# EAGLE design snow depth gauge 2B (EAGLE 6.5.0)
Trimble Ultrasonic Snow Depth Gauge
DATABASE: ./parts.txt
Assembly variants: 2B
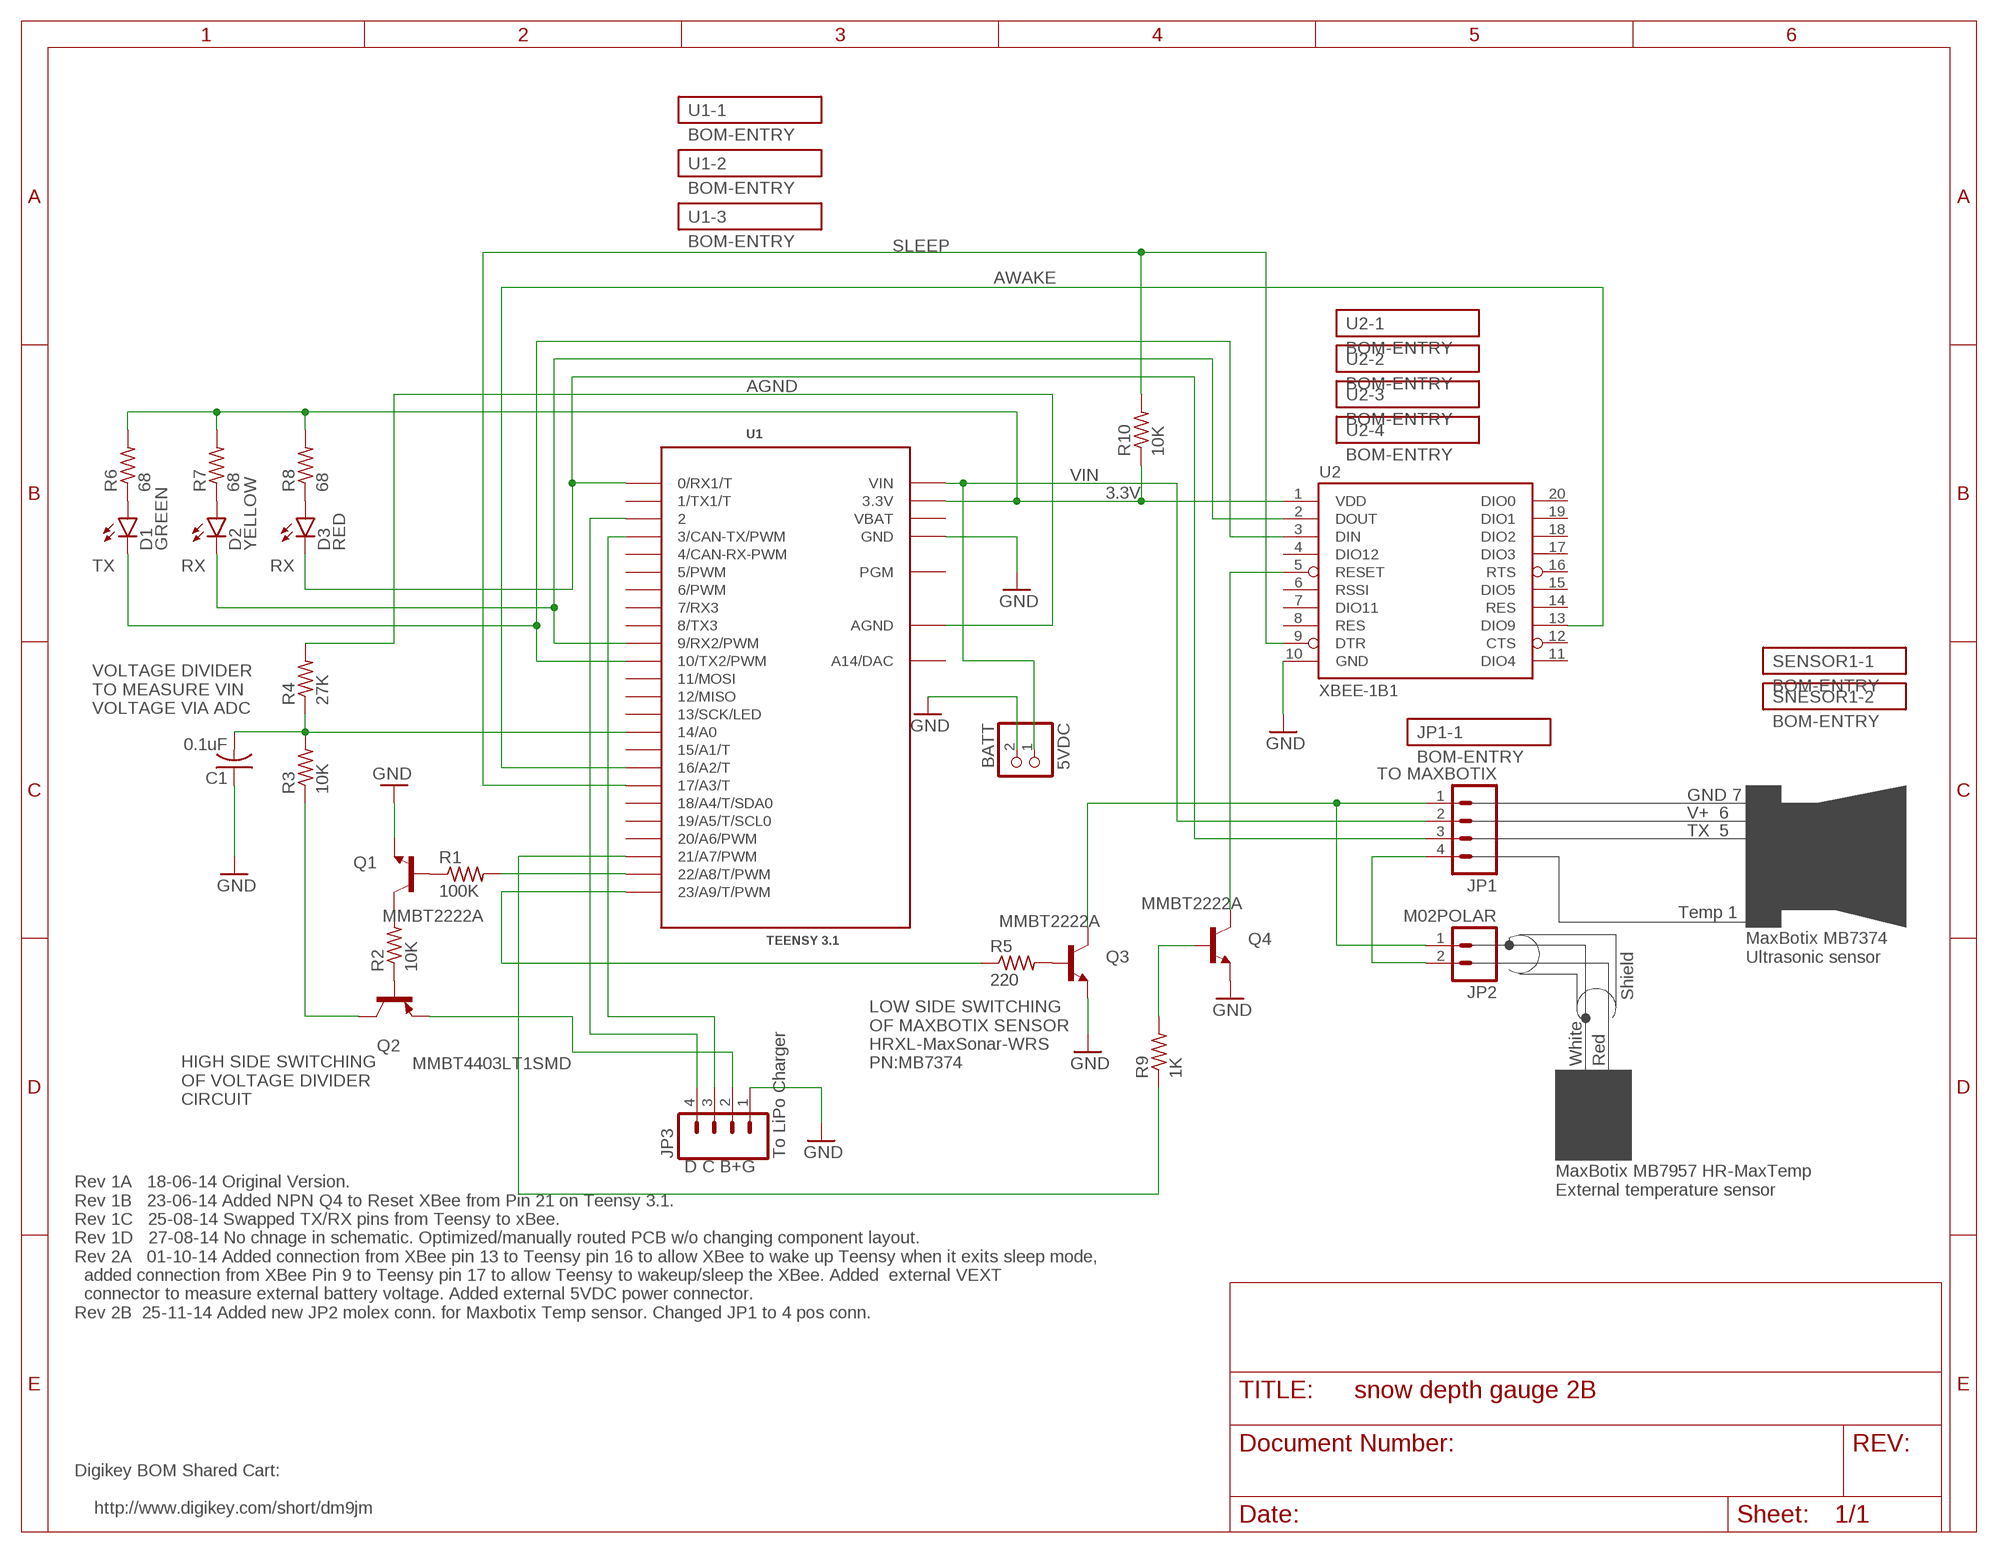
[diagram p0: schematic, sheet 1]
JP1-1 (BOM-ENTRY): PARTNO: PRT-09920
SENSOR1-1 (BOM-ENTRY): PARTNO: MB7374
SNESOR1-2 (BOM-ENTRY): PARTNO: MB7957
U1-1 (BOM-ENTRY): PARTNO: 961114-6404-AR
U1-2 (BOM-ENTRY): PARTNO: 961114-6404-AR
U1-3 (BOM-ENTRY): PARTNO: 961105-6404-AR
U2-1 (BOM-ENTRY): PARTNO: 831-87-010-10-001101
U2-2 (BOM-ENTRY): PARTNO: 831-87-010-10-001101
U2-3 (BOM-ENTRY): PARTNO: RN-UFL-SMA6
U2-4 (BOM-ENTRY): PARTNO: W1038

## Parts
BATT  5VDC  JST_2PIN-SMT-RA  [JST-PH-2-SMT-RA]
C1  0.1uF  C-USC3216  [C3216]
D1  GREEN  LED-GREEN0603  [LED-0603]
D2  YELLOW  LED-YELLOW0603  [LED-0603]
D3  RED  LED-RED0603  [LED-0603]
JP1  TO MAXBOTIX  M04POLAR  [MOLEX-1X4]
JP2  M02POLAR  [MOLEX-1X2]
JP3  To LiPo Charger  M04POLAR  [MOLEX-1X4]
Q1  MMBT2222A  MMBT2222ALT1-NPN-SOT23-BEC  [SOT23-BEC]
Q2  MMBT4403LT1SMD  [SOT23-BEC]
Q3  MMBT2222A  MMBT2222ALT1-NPN-SOT23-BEC  [SOT23-BEC]
Q4  MMBT2222A  MMBT2222ALT1-NPN-SOT23-BEC  [SOT23-BEC]
R1  100K  R-US_R3216  [R3216]
R2  10K  R-US_R3216  [R3216]
R3  10K  R-US_R3216  [R3216]
R4  27K  R-US_R3216  [R3216]
R5  220  R-US_R3216  [R3216]
R6  68  R-US_R3216  [R3216]
R7  68  R-US_R3216  [R3216]
R8  68  R-US_R3216  [R3216]
R9  1K  R-US_R3216  [R3216]
R10  10K  R-US_R3216  [R3216]
U1  TEENSY 3.1  TEENSY_3.1_BASIC  [TEENSY_3.1_BASIC]
U2  XBEE-1B1  [XBEE-1]

## Nets
3.3V: R6.2 R7.2 R8.2 R10.1 U1.3.3V U1.3.3V1(3.3V) U2.1(VDD)
22: R1.2 U1.22/A8(22/A8/T/PWM)
23: R5.1 U1.23/A9(23/A9/T/PWM)
A0: C1.2 R3.2 R4.1 U1.14/A0
AGND: R4.2 U1.AGND
AWAKE: U1.16/A2(16/A2/T) U2.13(DIO9)
GND: BATT.2 C1.1 JP3.1 Q1.E Q3.E Q4.E U1.GND U1.GND1(GND) U2.10(GND)
IN: D2.C U1.9(9/RX2/PWM) U2.2(DOUT)
MBGND: JP1.1 JP2.1 Q3.C
MBTEMP: JP1.4 JP2.2
N$1: D3.A R8.1
N$2: Q4.B R9.2
N$3: Q4.C U2.5(RESET)
N$4: JP3.2 Q2.E
N$5: Q3.B R5.2
N$6: Q1.B R1.1
N$7: Q1.C R2.2
N$8: Q2.B R2.1
N$9: D1.A R6.1
N$11: Q2.C R3.1
N$15: D2.A R7.1
OUT: D1.C U1.10(10/TX2/PWM) U2.3(DIN)
RESET: R9.1 U1.21/A7(21/A7/PWM)
RX1: D3.C JP1.3 U1.0(0/RX1/T)
SLEEP: R10.2 U1.17/A3(17/A3/T) U2.9(DTR)
STAT1: JP3.4 U1.2
STAT2: JP3.3 U1.3(3/CAN-TX/PWM)
VIN: BATT.1 JP1.2 U1.VIN
Unconnected: U1.1(1/TX1/T) U1.4(4/CAN-RX-PWM) U1.5(5/PWM) U1.6(6/PWM) U1.7(7/RX3) U1.8(8/TX3) U1.11(11/MOSI) U1.12(12/MISO) U1.13(13/SCK/LED) U1.15/A1(15/A1/T) U1.18/A4(18/A4/T/SDA0) U1.19/A5(19/A5/T/SCL0) U1.20/A6(20/A6/PWM) U1.A14(A14/DAC) U1.PGM U2.4(DIO12) U2.6(RSSI) U2.7(DIO11) U2.8(RES) U2.11(DIO4) U2.12(CTS) U2.14(RES) U2.15(DIO5) U2.16(RTS) U2.17(DIO3) U2.18(DIO2) U2.19(DIO1) U2.20(DIO0)

## Notes on the sheet
- TX | RX | RX
- VOLTAGE DIVIDER
  TO MEASURE VIN
  VOLTAGE VIA ADC
- GND 7
- V+  6
- TX  5
- Temp 1
- MaxBotix MB7374
  Ultrasonic sensor
- Shield
- White | Red
- LOW SIDE SWITCHING
  OF MAXBOTIX SENSOR
  HRXL-MaxSonar-WRS
  PN:MB7374
- HIGH SIDE SWITCHING
  OF VOLTAGE DIVIDER
  CIRCUIT
- D C B+G
- MaxBotix MB7957 HR-MaxTemp
  External temperature sensor
- Rev 1A   18-06-14 Original Version.
  Rev 1B   23-06-14 Added NPN Q4 to Reset XBee from Pin 21 on Teensy 3.1.
  Rev 1C   25-08-14 Swapped TX/RX pins from Teensy to xBee.
  Rev 1D   27-08-14 No chnage in schematic. Optimized/manually routed PCB w/o changing component layout.
  Rev 2A   01-10-14 Added connection from XBee pin 13 to Teensy pin 16 to allow XBee to wake up Teensy when it exits sleep mode,
    added connection from XBee Pin 9 to Teensy pin 17 to allow Teensy to wakeup/sleep the XBee. Added  external VEXT 
    connector to measure external battery voltage. Added external 5VDC power connector.
  Rev 2B  25-11-14 Added new JP2 molex conn. for Maxbotix Temp sensor. Changed JP1 to 4 pos conn.
- Digikey BOM Shared Cart: 
  
      http://www.digikey.com/short/dm9jm

## Power pins joined to a net without a drawn wire
VBAT: U1.VBAT

## Library data of the parts
BATT = adafruit:JST_2PIN: JST 2-Pin Connectors of various flavors SMT-RA (S2B-PH-SM4) 4UConnector #17311 SMT (B2B-PH-SM4) THM-RA (S2B-PH) THM (B2B-PH); PARTNO: S2B-PH-SM4-TB(LF)(SN)
C1 = resistor:C-US: CAPACITOR, American symbol; PARTNO: C1206C104K4RACTU
D1 = SparkFun-LED:LED-GREEN: Various green LEDs Green LEDs used in SFE Production 0603- DIO-00821 LARGE- DIO-00862 LILYPAD- DIO-09910; PARTNO: LNJ337W83RA; PROD_ID: DIO-00821
D2 = SparkFun-LED:LED-YELLOW: Yellow SMD LEDs LilyPad 1206- DIO-09909 0603- DIO-09003; PARTNO: LNJ437W84RA; PROD_ID: DIO-09003
D3 = SparkFun-LED:LED-RED: Assorted Red LEDs LilyPad 1206- DIO-09912 1206- DIO-00809 0603- DIO-00819; PARTNO: LNJ237W82RA; PROD_ID: DIO-00819
JP1 JP3 = SparkFun-Connectors:M04: Header 4 Standard 4-pin 0.1" header. Use with straight break away headers (SKU : PRT-00116), right angle break away headers (PRT-00553), swiss pins (PRT-00743), machine pins (PRT-00117), and female headers (PRT-00115). Molex polarized connector foot print use with SKU : PRT-08231 with associated crimp pins and housings. 1MM SMD Version SKU: PRT-10208; PARTNO: 0022292041
JP2 = SparkFun-Connectors:M02: Standard 2-pin 0.1" header. Use with - straight break away headers ( PRT-00116) - right angle break away headers (PRT-00553) - swiss pins (PRT-00743) - machine pins (PRT-00117) - female headers (PRT-00115) Molex polarized connector foot print use with: PRT-08233 with associated crimp pins and housings. 2.54_SCREWTERM for use with PRT-10571. 3.5mm Screw Terminal footprints for PRT-08084 5mm Screw Terminal footprints for use with PRT-08433; PARTNO: 0022292021
Q1 Q3 Q4 = transistor-neu-to92:*-NPN-: NPN Transistror; PARTNO: MMBT2222A
Q2 = transistor-pnp:MMBT4403*: PNP Transistror; PARTNO: MMBT4403
R1 = resistor:R-US_: RESISTOR, American symbol; PARTNO: KTR18EZPJ104
R2 R3 R10 = resistor:R-US_: RESISTOR, American symbol; PARTNO: KTR18EZPJ103
R4 = resistor:R-US_: RESISTOR, American symbol; PARTNO: KTR18EZPJ273
R5 = resistor:R-US_: RESISTOR, American symbol; PARTNO: KTR18EZPJ221
R6-R8 = resistor:R-US_: RESISTOR, American symbol; PARTNO: KTR18EZPJ680
R9 = resistor:R-US_: RESISTOR, American symbol; PARTNO: KTR18EZPJ102
U1 = Teensy_3_Series_Board_v1.0:TEENSY_3.1_BASIC: Footprint for Teensy 3.1 board using all pin connections on the outer perimeter; PARTNO: TEENSY31
U2 = SparkFun-RF:XBEE-1: Xbee module footprints SMT header is CONN-09042.; PARTNO: XB24-AUI-001

## Board
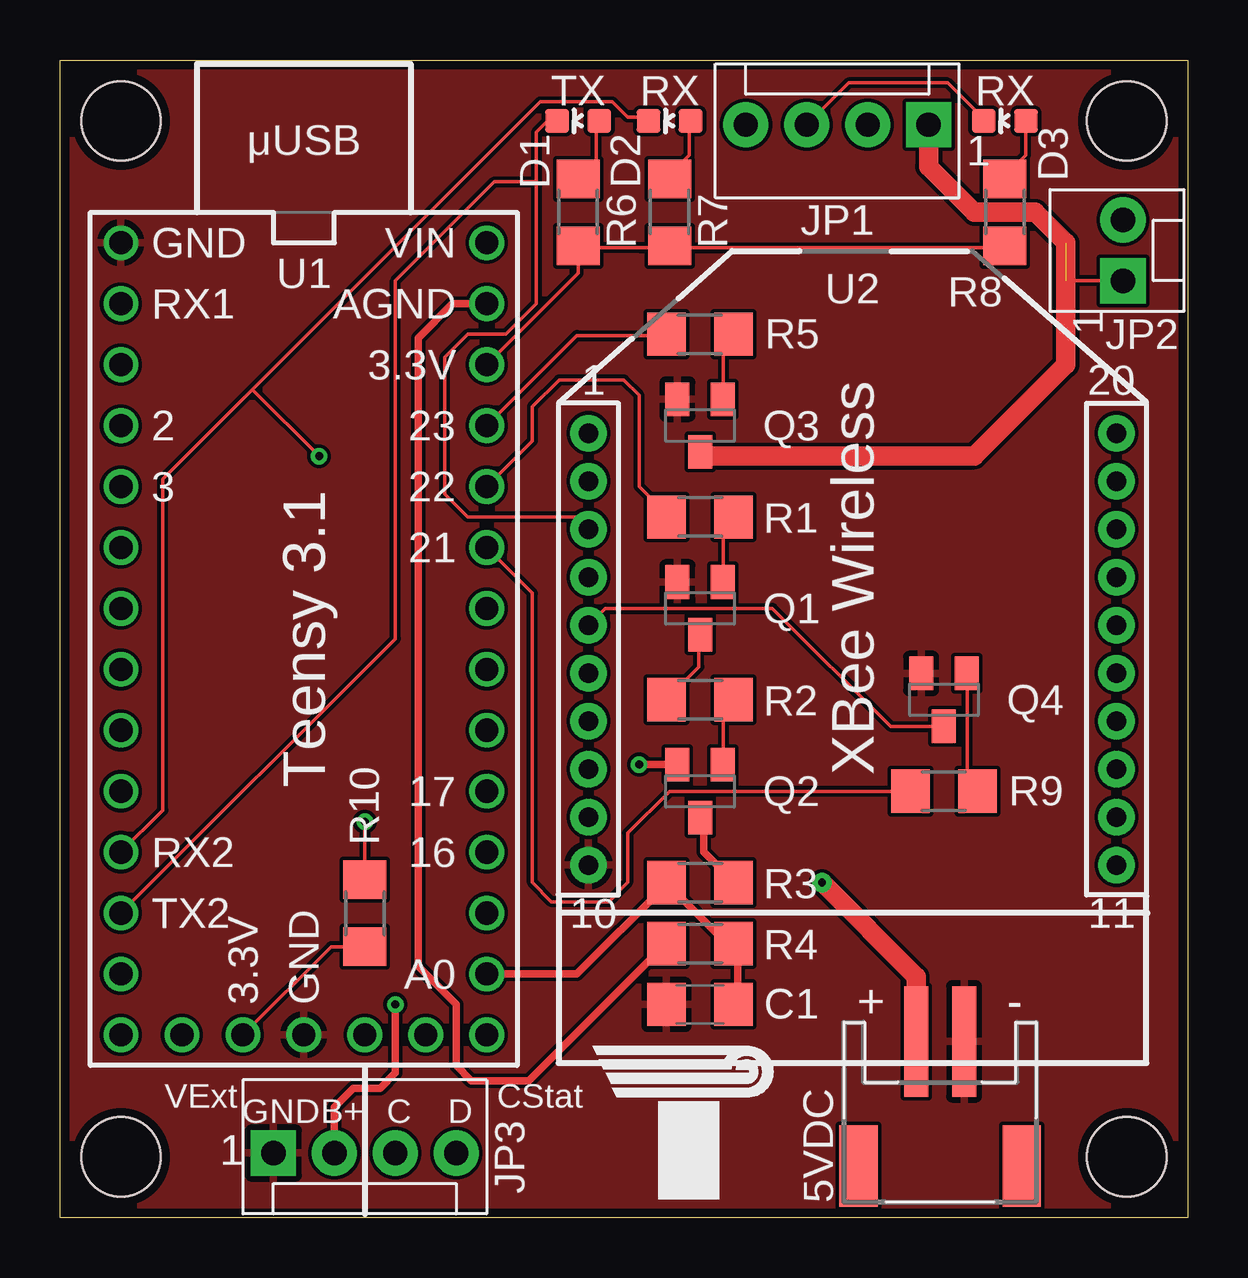
[diagram p1: board, top side]
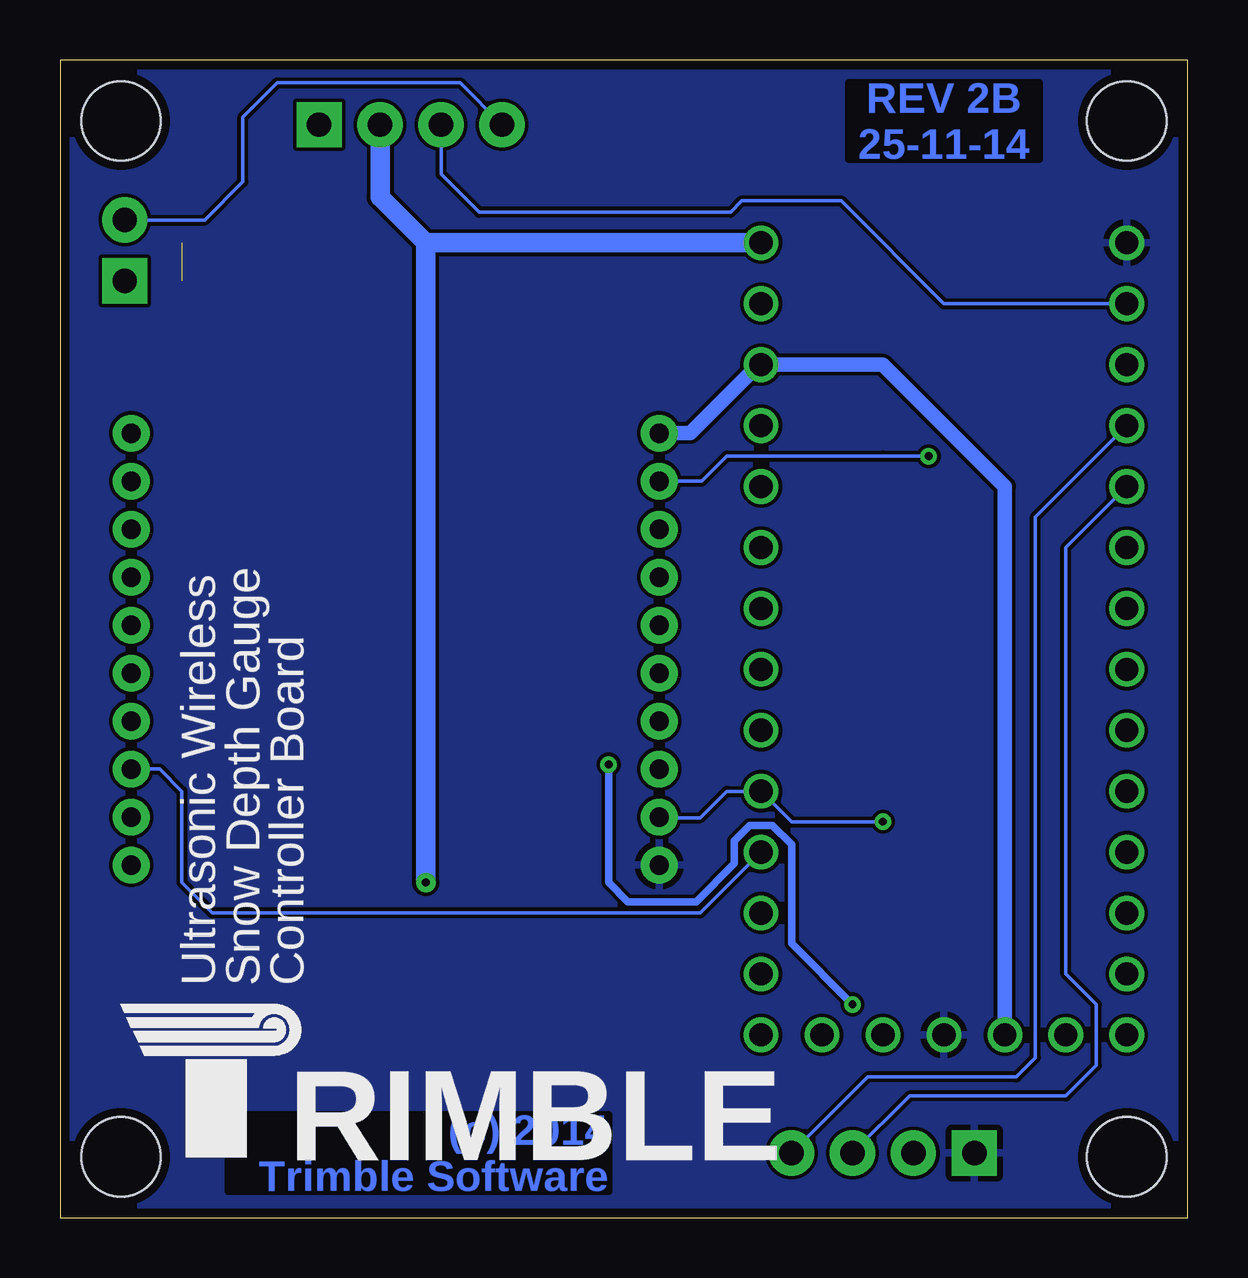
[diagram p2: board, bottom side, seen from below]

Size 46.99 x 48.26 mm. Coordinates in mm from the lower left corner, seen from the top.
Outline: 0,0 0,48.26 46.99,48.26 46.99,0 0,0
Copper layers (1*16): Top 0.0356mm / dielectric 1.5011mm / Bottom 0.0356mm
Design rules "LaenPCBOrder": minimum track width 6mil, minimum drill 13mil, track to track 6mil, track to pad 6mil, pad to pad 6mil, via to via 6mil, smd to smd 6mil, copper to edge 15mil, drill to drill 6mil, minimum pad ring 7mil, minimum via ring 7mil, stop-mask expansion 3mil, vias tented up to drill 0mil, thermal gap 10mil
tKeepout: area 5.7,41.9 to 14.6,48.3

### Footprints (pad centres in the part's own frame; a part is rotated, then mirrored left to right if it is on the bottom)
JST-PH-2-SMT-RA = smd 1 x 4.6: 1 1,-3.7; 2 -1,-3.7 | smd 1.6 x 3.4: NC1 -3.4,1.5; NC2 3.4,1.5
C3216 = smd 1.6 x 1.8: 1 -1.4,0; 2 1.4,0
LED-0603 = smd 1 x 1: A 0,-0.877; C 0,0.877
MOLEX-1X4 = drill 1.016 pad 1.88 square: 1 0,0 | drill 1.016 pad 1.88: 2 2.54,0; 3 5.08,0; 4 7.62,0
MOLEX-1X2 = drill 1.016 pad 1.88 square: 1 0,0 | drill 1.016 pad 1.88: 2 2.54,0
SOT23-BEC = smd 1 x 1.4: B -0.95,-1.1; C 0,1.1; E 0.95,-1.1
R3216 = smd 1.6 x 1.8: 1 -1.4,0; 2 1.4,0
TEENSY_3.1_BASIC = drill 0.965: 0 -7.62,13.97; 1 -7.62,11.43; 2 -7.62,8.89; 3 -7.62,6.35; 3.3V 7.62,11.43; 3.3V1 -2.54,-16.51; 4 -7.62,3.81; 5 -7.62,1.27; 6 -7.62,-1.27; 7 -7.62,-3.81; 8 -7.62,-6.35; 9 -7.62,-8.89; 10 -7.62,-11.43; 11 -7.62,-13.97; 12 -7.62,-16.51; 13 7.62,-16.51; 14/A0 7.62,-13.97; 15/A1 7.62,-11.43; 16/A2 7.62,-8.89; 17/A3 7.62,-6.35; 18/A4 7.62,-3.81; 19/A5 7.62,-1.27; 20/A6 7.62,1.27; 21/A7 7.62,3.81; 22/A8 7.62,6.35; 23/A9 7.62,8.89; A14 5.08,-16.51; AGND 7.62,13.97; GND -7.62,16.51; GND1 0,-16.51; PGM 2.54,-16.51; VBAT -5.08,-16.51; VIN 7.62,16.51
XBEE-1 = drill 0.8 pad 1.524: 1 -11,20; 2 -11,18; 3 -11,16; 4 -11,14; 5 -11,12; 6 -11,10; 7 -11,8; 8 -11,6; 9 -11,4; 10 -11,2; 11 11,2; 12 11,4; 13 11,6; 14 11,8; 15 11,10; 16 11,12; 17 11,14; 18 11,16; 19 11,18; 20 11,20
STAND-OFF = hole 3.302: 0,0

### Placement (x,y rotation side)
BATT  36.67,3.65 180 top
C1  26.67,8.89 0 top
D1  21.59,45.72 90 top
D2  25.4,45.72 90 top
D3  39.37,45.72 90 top
JP1  36.2,45.56 180 top
JP2  44.29,39.05 90 top
JP3  8.89,2.7 0 top
Q1  26.67,25.4 180 top
Q2  26.67,17.78 180 top
Q3  26.67,33.02 180 top
Q4  36.83,21.59 180 top
R1  26.67,29.21 180 top
R2  26.67,21.59 180 top
R3  26.67,13.97 180 top
R4  26.67,11.43 180 top
R5  26.67,36.83 0 top
R6  21.59,41.91 270 top
R7  25.4,41.91 270 top
R8  39.37,41.91 270 top
R9  36.83,17.78 0 top
R10  12.7,12.7 90 top
U1  10.16,24.13 0 top
U2  33.02,12.7 0 top
U$1  [STAND-OFF]  2.54,2.54 0 top
U$2  [STAND-OFF]  2.54,45.72 0 top
U$3  [STAND-OFF]  44.45,2.54 0 top
U$4  [STAND-OFF]  44.45,45.72 0 top
U$5  [LOGO_4]  24.92,0.79 0 top
U$6  [LOGO_4_BOTTOM]  41.75,2.54 0 top

### Tracks (layer width: path | path; a pad name or v marks a point on that pad's centre or on a via)
3.3V
  Top 0.152: 24.18,40.44 39.22,40.44 R8.2 | 24.18,40.44 R7.2 | 24.18,40.44 21.74,40.44 R6.2 | 21.54,40.44 R6.2 | U1.3.3V 21.59,39.37 R6.2 | R10.1 11.3,11.3 U1.3.3V1
  Bottom 0.152: 17.68,35.56 U1.3.3V 17.88,35.56 | 21.95,32.72 U2.1
  Bottom 0.61: 21.95,32.72 20.73,32.72 17.88,35.56 | U1.3.3V1 7.62,30.48 12.7,35.56 U1.3.3V
22
  Top 0.152: R1.2 25.2,29.26 24.77,29.69 24.77,29.84 24.13,30.48 24.13,34.29 23.5,34.92 20.8,34.92 19.68,33.81 19.68,32.38 U1.22/A8
23
  Top 0.152: U1.23/A9 21.54,36.78 25.2,36.78 R5.1
A0
  Top 0.152: 25.2,13.82 R3.2 25.4,13.82 | 28.25,8.94 C1.2 | 28.25,11.38 R4.1 28.04,11.58 27.64,11.58
  Top 0.305: U1.14/A0 21.54,10.16 25.2,13.82 | 28.25,11.38 28.25,8.94 | 25.4,13.82 27.64,11.58
AGND
  Top 0.152: 25.2,11.38 R4.2
  Top 0.305: 25.2,11.38 19.53,5.71 17.14,5.71 16.51,6.35 16.51,8.89 14.92,10.48 14.92,36.67 16.35,38.1 U1.AGND
AWAKE
  Bottom 0.152: U2.13 42.83,18.7 41.91,17.78 41.91,13.97 40.64,12.7 20.32,12.7 U1.16/A2
GND
  pour Bottom: 0,48.26 46.99,48.26 46.99,0 0,0
  pour Top: 0,48.26 46.99,48.26 46.99,0 0,0
IN  (via drill 0.33)
  Top 0.152: U1.9 4.29,16.99 4.29,30.8 8.02,34.53 | D2.C 24.36,45.88 23.65,45.88 23.02,46.51 20,46.51 8.02,34.53 | v10.79,31.74 8.02,34.52 8.02,34.53
  Bottom 0.152: U2.2 20.26,30.7 19.21,31.75 12.7,31.75 v10.79,31.74
MBGND  (1 unrouted)
  Top 0.152: Q3.C 26.62,31.9 26.84,31.75 | JP2.1 41.91,39.05
  Top 0.813: 26.84,31.75 38.1,31.75 41.91,35.56 41.91,40.64 40.64,41.91 38.1,41.91 36.2,43.81 JP1.1
MBTEMP
  Bottom 0.152: JP2.2 40.96,41.59 39.37,43.18 39.37,45.88 37.94,47.31 30.32,47.31 JP1.4
N$1
  Top 0.152: D3.A 40.23,45.72 40.23,44.3 39.42,43.48 R8.1
N$2
  Top 0.152: Q4.B 37.8,22.55 37.8,18.29 38.2,17.88 R9.2
N$3
  Top 0.152: 36.78,20.52 Q4.C 36.82,20.48 34.61,20.48 29.69,25.4 22.72,25.4 U2.5
N$4  (via drill 0.33)
  Top 0.305: Q2.E 25.71,18.89 v24.13,18.89 | JP3.2 11.43,4.6 12.22,5.4 13.34,5.4 13.97,6.03 v13.97,8.89
  Bottom 0.305: v13.97,8.89 16.51,11.43 16.51,15.56 17.3,16.35 18.26,16.35 18.89,15.72 18.89,14.76 20.48,13.18 23.34,13.18 24.13,13.97 v24.13,18.89
N$5
  Top 0.152: Q3.B 27.64,34.14 27.64,36.37 28.04,36.78 R5.2
N$6
  Top 0.152: Q1.B 27.64,26.62 27.64,28.65 28.04,29.06 R1.1
N$7
  Top 0.152: Q1.C 26.62,24.18 26.62,22.96 25.4,21.74 R2.2
N$8
  Top 0.152: Q2.B 27.64,18.9 27.64,21.13 28.04,21.54 R2.1
N$9
  Top 0.152: D1.A 22.35,45.72 22.35,44.09 21.74,43.48 R6.1
N$11
  Top 0.152: 26.82,16.66 Q2.C | 28.04,14.02 R3.1
  Top 0.305: 26.82,16.66 26.82,15.24 28.04,14.02
N$15
  Top 0.152: D2.A 26.21,45.72 26.21,44.3 25.4,43.48 R7.1
OUT
  Top 0.152: U2.3 21.51,29.21 16.99,29.21 16.03,30.16 16.03,35.88 16.99,36.83 18.57,36.83 19.84,38.1 19.84,43.18 | D1.C 20.32,45.72 19.84,45.24 19.84,43.18 | U1.10 13.97,24.13 13.97,39.05 18.1,43.18 19.84,43.18
RESET
  Top 0.152: U1.21/A7 19.68,26.04 19.68,13.97 20.48,13.18 22.86,13.18 23.65,13.97 23.65,16.03 25.4,17.78 35.26,17.78 35.36,17.68 R9.1
RX1
  Top 0.152: D3.C 38.49,45.8 36.99,47.31 32.86,47.31 JP1.3
  Bottom 0.152: U1.0 10.16,38.1 14.45,42.39 18.57,42.39 19.05,41.91 29.53,41.91 31.11,43.5 JP1.3
SLEEP  (via drill 0.33)
  Top 0.152: v12.7,16.51 R10.2
  Bottom 0.152: U2.9 21.99,16.67 20.32,16.67 19.21,17.78 U1.17/A3 16.51,16.51 v12.7,16.51
STAT1
  Bottom 0.152: U1.2 6.35,29.21 6.35,6.67 7.14,5.87 13.34,5.87 JP3.4
STAT2
  Bottom 0.152: U1.3 5.08,27.94 5.08,10.16 3.81,8.89 3.81,6.35 5.08,5.08 11.59,5.08 JP3.3
VIN  (via drill 0.33 pad 0.81)
  Top 0.813: BATT.1 35.67,10.05 v31.75,13.97
  Bottom 0.813: 31.75,40.64 U1.VIN | v31.75,13.97 31.75,40.64 | 31.75,40.64 33.66,42.55 JP1.2

### Text on the board
Bottom: REV 2B / 25-11-14 | (c) 2014 / Trimble Software
tPlace: TX | RX | RX | μUSB | 1 | JP1 | GND | VIN | RX1 | AGND | 1 | JP2 | 3.3V | 1 | 20 | 2 | 23 | 3 | 22 | 21 | XBee Wireless | Teensy 3.1 | 17 | RX2 | 16 | TX2 | 10 | 11 | A0 | 3.3V | GND | VExt | CStat | GND | B+ | C | D | 1 | JP3 | 5VDC
bPlace: Ultrasonic Wireless / Snow Depth Gauge / Controller Board | RIMBLE